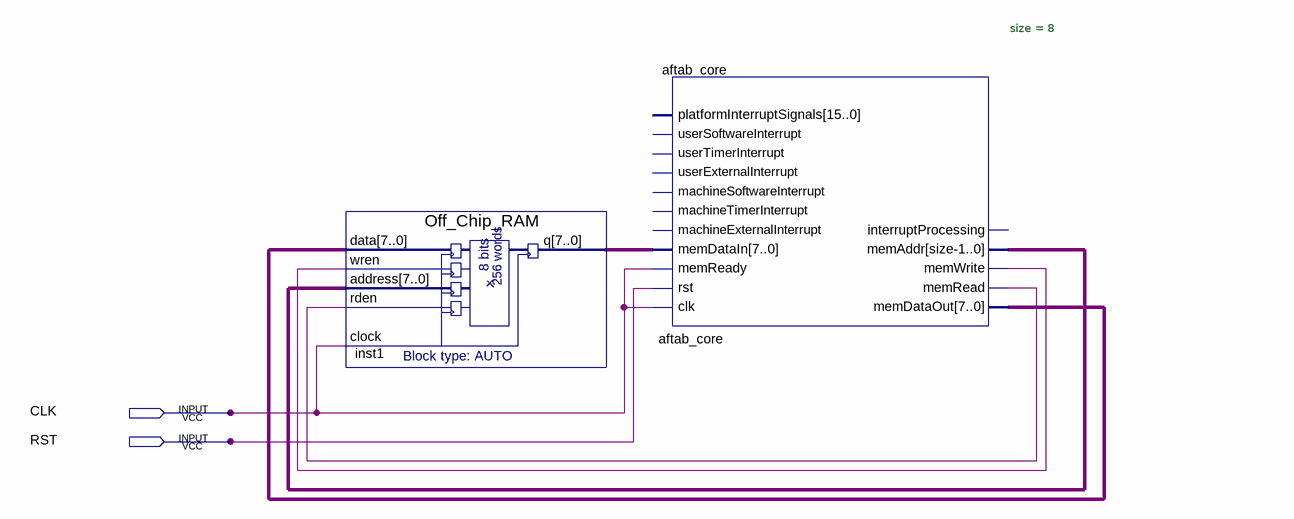
[diagram p0: schematic sheet]
// Quartus schematic aftab_Processor.bdf as structural Verilog: 2 symbols, 2 pins
module aftab_Processor (
  input  CLK,
  input  RST
);

  wire aftab_core_memread, aftab_core_memwrite;
  wire [7:0] aftab_core_memaddr, aftab_core_memdataout, inst1_q;

  Off_Chip_RAM inst1 (
    .data(aftab_core_memdataout), .wren(aftab_core_memwrite), .address(aftab_core_memaddr),
    .rden(aftab_core_memread), .clock(CLK), .q(inst1_q));
  aftab_core #(.size(8)) aftab_core (
    .clk(CLK), .rst(RST), .memReady(CLK), .memDataIn(inst1_q), .memDataOut(aftab_core_memdataout),
    .memRead(aftab_core_memread), .memWrite(aftab_core_memwrite), .memAddr(aftab_core_memaddr));  // open: machineExternalInterrupt, machineTimerInterrupt, machineSoftwareInterrupt, userExternalInterrupt, userTimerInterrupt, userSoftwareInterrupt, platformInterruptSignals, interruptProcessing
endmodule
